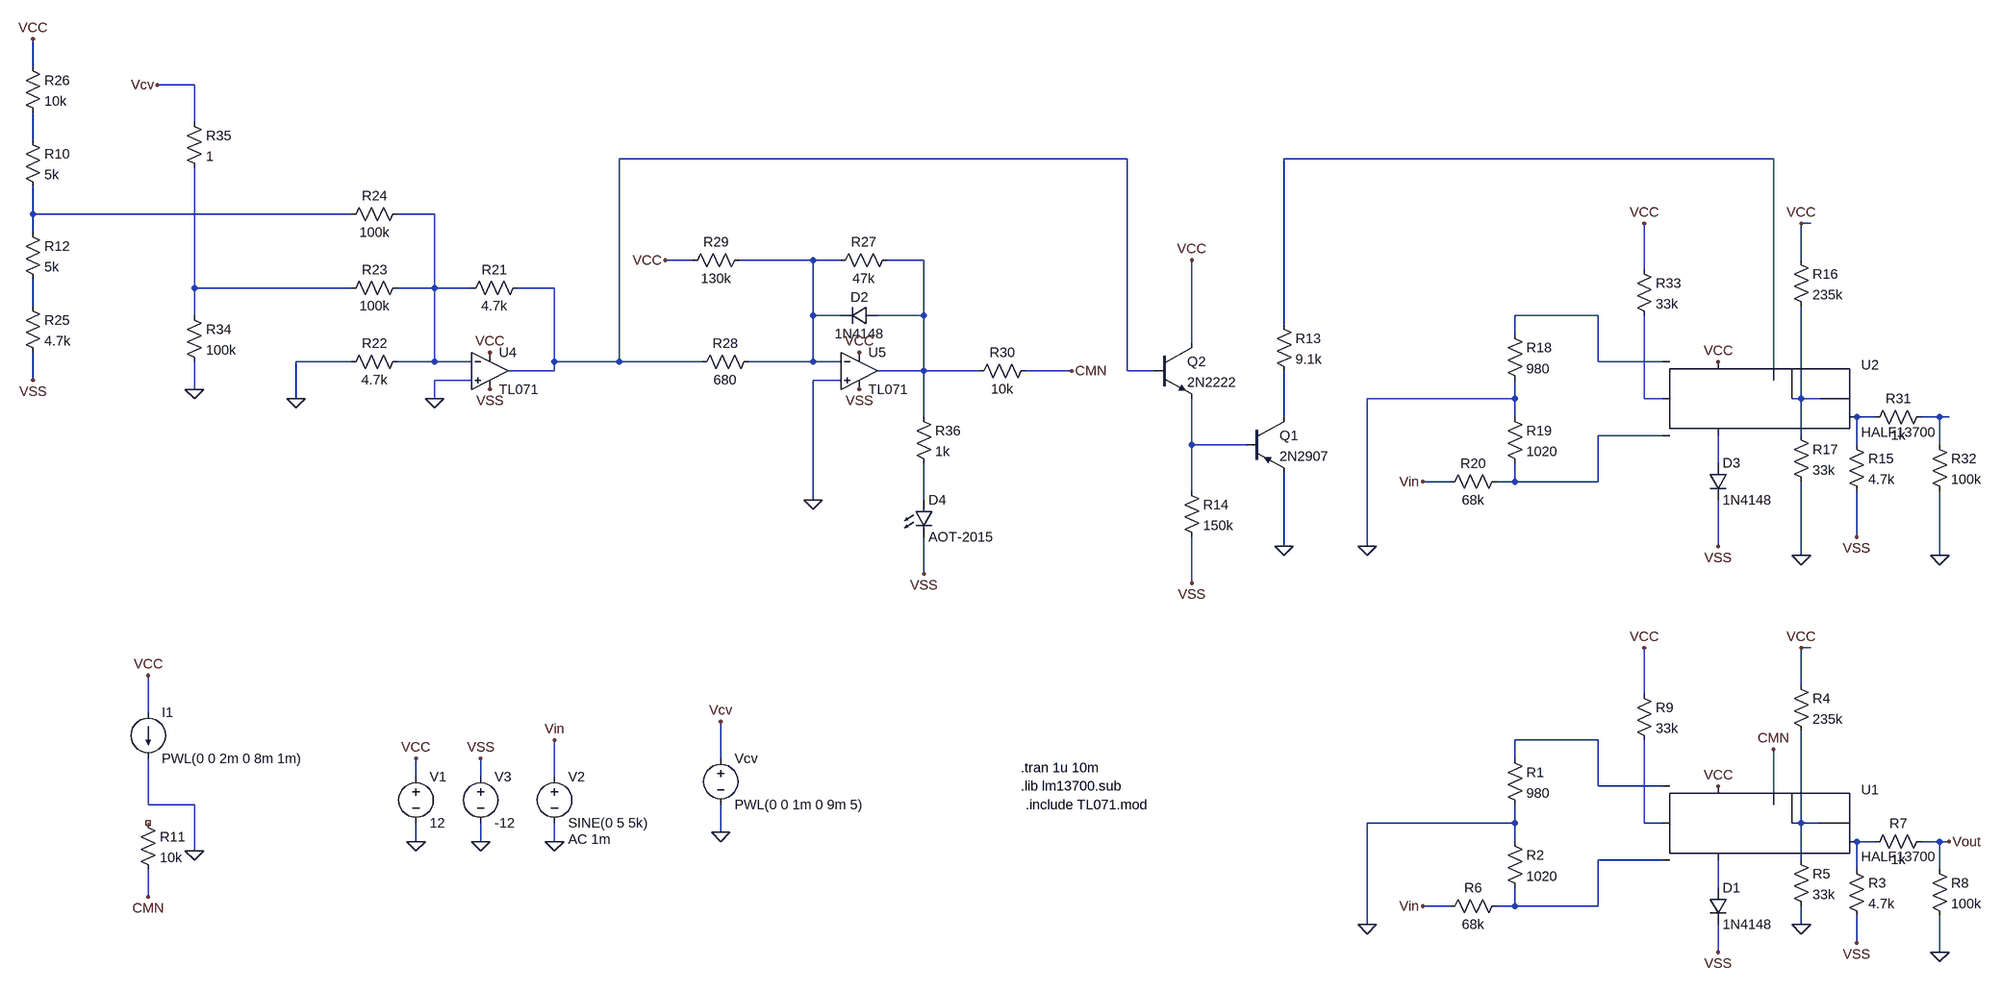
[diagram p0: schematic Linear.asc]
Linear.asc, the LTspice schematic file:
Version 4
SHEET 1 4476 1404
WIRE 608 -224 608 -272
WIRE 896 -192 832 -192
WIRE 896 -128 896 -192
WIRE 608 -96 608 -144
WIRE 2512 -64 1632 -64
WIRE 3632 -64 2784 -64
WIRE 608 32 608 -16
WIRE 1168 32 608 32
WIRE 1312 32 1248 32
WIRE 3696 48 3680 48
WIRE 608 64 608 32
WIRE 1760 112 1712 112
WIRE 1968 112 1840 112
WIRE 2016 112 1968 112
WIRE 2160 112 2096 112
WIRE 3680 112 3680 48
WIRE 3408 128 3408 48
WIRE 896 160 896 -48
WIRE 1168 160 896 160
WIRE 1312 160 1312 32
WIRE 1312 160 1248 160
WIRE 1376 160 1312 160
WIRE 1520 160 1456 160
WIRE 608 192 608 144
WIRE 896 208 896 160
WIRE 1968 208 1968 112
WIRE 2016 208 1968 208
WIRE 2160 208 2160 112
WIRE 2160 208 2080 208
WIRE 3328 208 3184 208
WIRE 2784 224 2784 -64
WIRE 3184 240 3184 208
WIRE 2624 256 2624 112
WIRE 1168 288 1072 288
WIRE 1312 288 1312 160
WIRE 1312 288 1248 288
WIRE 1376 288 1312 288
WIRE 1520 288 1520 160
WIRE 1632 288 1632 -64
WIRE 1632 288 1520 288
WIRE 1776 288 1632 288
WIRE 1968 288 1968 208
WIRE 1968 288 1856 288
WIRE 2016 288 1968 288
WIRE 3328 288 3328 208
WIRE 3440 288 3328 288
WIRE 1520 304 1520 288
WIRE 1520 304 1440 304
WIRE 2160 304 2160 208
WIRE 2160 304 2080 304
WIRE 2256 304 2160 304
WIRE 2416 304 2336 304
WIRE 2512 304 2512 -64
WIRE 2560 304 2512 304
WIRE 608 320 608 272
WIRE 1376 320 1312 320
WIRE 2016 320 1968 320
WIRE 3632 320 3632 -64
WIRE 896 336 896 288
WIRE 1072 352 1072 288
WIRE 1312 352 1312 320
WIRE 3184 352 3184 320
WIRE 3184 352 2928 352
WIRE 3408 352 3408 208
WIRE 3440 352 3408 352
WIRE 3680 352 3680 192
WIRE 3680 352 3664 352
WIRE 3712 352 3680 352
WIRE 2160 384 2160 304
WIRE 2784 384 2784 304
WIRE 3184 384 3184 352
WIRE 3808 384 3776 384
WIRE 3920 384 3888 384
WIRE 3936 384 3920 384
WIRE 3440 416 3328 416
WIRE 3680 416 3680 352
WIRE 2624 432 2624 352
WIRE 2720 432 2624 432
WIRE 3776 432 3776 384
WIRE 3920 432 3920 384
WIRE 3536 464 3536 416
WIRE 3072 496 3024 496
WIRE 3184 496 3184 464
WIRE 3184 496 3152 496
WIRE 3328 496 3328 416
WIRE 3328 496 3184 496
WIRE 2624 512 2624 432
WIRE 1968 528 1968 320
WIRE 2160 528 2160 464
WIRE 3776 592 3776 512
WIRE 2784 608 2784 480
WIRE 2928 608 2928 352
WIRE 3536 608 3536 528
WIRE 3680 624 3680 496
WIRE 3920 624 3920 512
WIRE 2160 656 2160 592
WIRE 2624 672 2624 592
WIRE 3696 784 3680 784
WIRE 3680 848 3680 784
WIRE 3408 864 3408 784
WIRE 816 896 816 832
WIRE 3328 944 3184 944
WIRE 1808 976 1808 912
WIRE 3184 976 3184 944
WIRE 1280 1008 1280 976
WIRE 1392 1008 1392 976
WIRE 1520 1008 1520 944
WIRE 3328 1024 3328 944
WIRE 3440 1024 3328 1024
WIRE 816 1056 816 976
WIRE 896 1056 816 1056
WIRE 3632 1056 3632 960
WIRE 3184 1088 3184 1056
WIRE 3184 1088 2928 1088
WIRE 3408 1088 3408 944
WIRE 3440 1088 3408 1088
WIRE 3680 1088 3680 928
WIRE 3680 1088 3664 1088
WIRE 3712 1088 3680 1088
WIRE 1808 1104 1808 1056
WIRE 1280 1120 1280 1088
WIRE 1392 1120 1392 1088
WIRE 1520 1120 1520 1088
WIRE 3184 1120 3184 1088
WIRE 3808 1120 3776 1120
WIRE 3920 1120 3888 1120
WIRE 3936 1120 3920 1120
WIRE 896 1136 896 1056
WIRE 3440 1152 3328 1152
WIRE 3680 1152 3680 1088
WIRE 3776 1168 3776 1120
WIRE 3920 1168 3920 1120
WIRE 3536 1200 3536 1152
WIRE 816 1216 816 1168
WIRE 3072 1232 3024 1232
WIRE 3184 1232 3184 1200
WIRE 3184 1232 3152 1232
WIRE 3328 1232 3328 1152
WIRE 3328 1232 3184 1232
WIRE 2928 1264 2928 1088
WIRE 3680 1264 3680 1232
WIRE 3776 1296 3776 1248
WIRE 3536 1312 3536 1264
WIRE 3920 1312 3920 1248
FLAG 1280 1120 0
FLAG 1280 976 VCC
FLAG 3536 1312 VSS
FLAG 3536 1024 VCC
FLAG 816 832 VCC
FLAG 3680 784 VCC
FLAG 1392 1120 0
FLAG 1392 976 VSS
FLAG 1520 1120 0
FLAG 3680 1264 0
FLAG 3776 1296 VSS
FLAG 1520 944 Vin
FLAG 3024 1232 Vin
FLAG 2928 1264 0
FLAG 3936 1120 Vout
FLAG 3920 1312 0
FLAG 3408 784 VCC
FLAG 3632 960 CMN
FLAG 816 1216 CMN
FLAG 1808 1104 0
FLAG 1808 912 Vcv
FLAG 896 1136 0
FLAG 1408 272 VCC
FLAG 1408 336 VSS
FLAG 1072 352 0
FLAG 1312 352 0
FLAG 608 320 VSS
FLAG 1968 528 0
FLAG 1712 112 VCC
FLAG 2048 272 VCC
FLAG 2048 336 VSS
FLAG 2416 304 CMN
FLAG 608 -272 VCC
FLAG 2624 672 VSS
FLAG 2624 112 VCC
FLAG 3536 608 VSS
FLAG 3536 288 VCC
FLAG 3680 48 VCC
FLAG 3680 624 0
FLAG 3776 592 VSS
FLAG 3024 496 Vin
FLAG 2928 608 0
FLAG 3920 624 0
FLAG 3408 48 VCC
FLAG 896 336 0
FLAG 832 -192 Vcv
FLAG 2784 608 0
FLAG 2160 656 VSS
SYMBOL LM13700 3504 1008 R0
SYMATTR InstName U1
SYMBOL voltage 1280 992 R0
WINDOW 123 0 0 Left 2
WINDOW 39 0 0 Left 2
SYMATTR InstName V1
SYMATTR Value 12
SYMBOL res 3760 1152 R0
SYMATTR InstName R3
SYMATTR Value 4.7k
SYMBOL voltage 1520 992 R0
WINDOW 123 24 124 Left 2
WINDOW 39 0 0 Left 2
SYMATTR Value2 AC 1m
SYMATTR InstName V2
SYMATTR Value SINE(0 5 5k)
SYMBOL current 816 896 R0
SYMATTR InstName I1
SYMATTR Value PWL(0 0 2m 0 8m 1m)
SYMBOL res 3664 832 R0
SYMATTR InstName R4
SYMATTR Value 235k
SYMBOL res 3664 1136 R0
SYMATTR InstName R5
SYMATTR Value 33k
SYMBOL voltage 1392 992 R0
WINDOW 123 0 0 Left 2
WINDOW 39 0 0 Left 2
SYMATTR InstName V3
SYMATTR Value -12
SYMBOL res 3168 960 R0
SYMATTR InstName R1
SYMATTR Value 980
SYMBOL res 3168 1104 R0
SYMATTR InstName R2
SYMATTR Value 1020
SYMBOL res 3168 1216 R90
WINDOW 0 0 56 VBottom 2
WINDOW 3 32 56 VTop 2
SYMATTR InstName R6
SYMATTR Value 68k
SYMBOL res 3904 1104 R90
WINDOW 0 0 56 VBottom 2
WINDOW 3 32 56 VTop 2
SYMATTR InstName R7
SYMATTR Value 1k
SYMBOL res 3904 1152 R0
SYMATTR InstName R8
SYMATTR Value 100k
SYMBOL res 3392 848 R0
SYMATTR InstName R9
SYMATTR Value 33k
SYMBOL res 800 1072 R0
SYMATTR InstName R11
SYMATTR Value 10k
SYMBOL voltage 1808 960 R0
SYMATTR InstName Vcv
SYMATTR Value PWL(0 0 1m 0 9m 5)
SYMBOL Opamps\\opamp2 1408 240 R0
SYMATTR InstName U4
SYMATTR Value TL071
SYMBOL res 1472 144 R90
WINDOW 0 0 56 VBottom 2
WINDOW 3 32 56 VTop 2
SYMATTR InstName R21
SYMATTR Value 4.7k
SYMBOL res 1264 272 R90
WINDOW 0 0 56 VBottom 2
WINDOW 3 32 56 VTop 2
SYMATTR InstName R22
SYMATTR Value 4.7k
SYMBOL res 1264 144 R90
WINDOW 0 0 56 VBottom 2
WINDOW 3 32 56 VTop 2
SYMATTR InstName R23
SYMATTR Value 100k
SYMBOL res 1264 16 R90
WINDOW 0 0 56 VBottom 2
WINDOW 3 32 56 VTop 2
SYMATTR InstName R24
SYMATTR Value 100k
SYMBOL res 592 176 R0
SYMATTR InstName R25
SYMATTR Value 4.7k
SYMBOL res 592 -240 R0
SYMATTR InstName R26
SYMATTR Value 10k
SYMBOL Opamps\\opamp2 2048 240 R0
SYMATTR InstName U5
SYMATTR Value TL071
SYMBOL res 2112 96 R90
WINDOW 0 0 56 VBottom 2
WINDOW 3 32 56 VTop 2
SYMATTR InstName R27
SYMATTR Value 47k
SYMBOL res 1872 272 R90
WINDOW 0 0 56 VBottom 2
WINDOW 3 32 56 VTop 2
SYMATTR InstName R28
SYMATTR Value 680
SYMBOL res 1856 96 R90
WINDOW 0 0 56 VBottom 2
WINDOW 3 32 56 VTop 2
SYMATTR InstName R29
SYMATTR Value 130k
SYMBOL diode 2080 192 R90
WINDOW 0 0 32 VBottom 2
WINDOW 3 32 32 VTop 2
SYMATTR InstName D2
SYMATTR Value 1N4148
SYMBOL res 2352 288 R90
WINDOW 0 0 56 VBottom 2
WINDOW 3 32 56 VTop 2
SYMATTR InstName R30
SYMATTR Value 10k
SYMBOL diode 3520 1200 R0
SYMATTR InstName D1
SYMATTR Value 1N4148
SYMBOL res 592 -112 R0
SYMATTR InstName R10
SYMATTR Value 5k
SYMBOL res 592 48 R0
SYMATTR InstName R12
SYMATTR Value 5k
SYMBOL pnp 2720 384 R0
SYMATTR InstName Q1
SYMATTR Value 2N2907
SYMBOL npn 2560 256 R0
SYMATTR InstName Q2
SYMATTR Value 2N2222
SYMBOL res 2768 208 R0
SYMATTR InstName R13
SYMATTR Value 9.1k
SYMBOL res 2608 496 R0
SYMATTR InstName R14
SYMATTR Value 150k
SYMBOL LM13700 3504 272 R0
SYMATTR InstName U2
SYMBOL res 3760 416 R0
SYMATTR InstName R15
SYMATTR Value 4.7k
SYMBOL res 3664 96 R0
SYMATTR InstName R16
SYMATTR Value 235k
SYMBOL res 3664 400 R0
SYMATTR InstName R17
SYMATTR Value 33k
SYMBOL res 3168 224 R0
SYMATTR InstName R18
SYMATTR Value 980
SYMBOL res 3168 368 R0
SYMATTR InstName R19
SYMATTR Value 1020
SYMBOL res 3168 480 R90
WINDOW 0 0 56 VBottom 2
WINDOW 3 32 56 VTop 2
SYMATTR InstName R20
SYMATTR Value 68k
SYMBOL res 3904 368 R90
WINDOW 0 0 56 VBottom 2
WINDOW 3 32 56 VTop 2
SYMATTR InstName R31
SYMATTR Value 1k
SYMBOL res 3904 416 R0
SYMATTR InstName R32
SYMATTR Value 100k
SYMBOL res 3392 112 R0
SYMATTR InstName R33
SYMATTR Value 33k
SYMBOL diode 3520 464 R0
SYMATTR InstName D3
SYMATTR Value 1N4148
SYMBOL res 880 192 R0
SYMATTR InstName R34
SYMATTR Value 100k
SYMBOL res 880 -144 R0
SYMATTR InstName R35
SYMATTR Value 1
SYMBOL res 2144 368 R0
SYMATTR InstName R36
SYMATTR Value 1k
SYMBOL LED 2144 528 R0
SYMATTR InstName D4
SYMATTR Value AOT-2015
SYMATTR Description Diode
SYMATTR Type diode
TEXT 2328 1024 Left 2 !.lib lm13700.sub
TEXT 2328 992 Left 2 !.tran 1u 10m
TEXT 2336 1056 Left 2 !.include TL071.mod

The netlist it stands for:
* Linear.asc
XU1 N021 N024 N020 CMN N022 VCC N025 N022 N023 HALF13700
V1 VCC 0 12
R3 N023 VSS 4.7k
V2 Vin 0 SINE(0 5 5k) AC 1m
I1 VCC 0 PWL(0 0 2m 0 8m 1m)
R4 VCC N022 235k
R5 N022 0 33k
V3 VSS 0 -12
R1 N020 0 980
R2 0 N024 1020
R6 N024 Vin 68k
R7 Vout N023 1k
R8 Vout 0 100k
R9 VCC N021 33k
R11 NC_01 CMN 10k
Vcv Vcv 0 PWL(0 0 1m 0 9m 5)
XU4 0 N005 VCC VSS N002 TL071  ; pins In+ In- V+ V- OUT
R21 N002 N005 4.7k
R22 N005 0 4.7k
R23 N005 N008 100k
R24 N005 N004 100k
R25 N009 VSS 4.7k
R26 VCC N001 10k
XU5 0 N006 VCC VSS N007 TL071  ; pins In+ In- V+ V- OUT
R27 N007 N006 47k
R28 N006 N002 680
R29 N006 VCC 130k
D2 N007 N006 1N4148
R30 CMN N007 10k
D1 N025 VSS 1N4148
R10 N001 N004 5k
R12 N004 N009 5k
Q1 N013 N017 0 0 2N2907
Q2 VCC N002 N017 0 2N2222
R13 N003 N013 9.1k
R14 N017 VSS 150k
XU2 N011 N016 N010 N003 N012 VCC N018 N012 N014 HALF13700
R15 N014 VSS 4.7k
R16 VCC N012 235k
R17 N012 0 33k
R18 N010 0 980
R19 0 N016 1020
R20 N016 Vin 68k
R31 N015 N014 1k
R32 N015 0 100k
R33 VCC N011 33k
D3 N018 VSS 1N4148
R34 N008 0 100k
R35 Vcv N008 1
R36 N007 N019 1k
D4 N019 VSS AOT-2015
.model D D
.lib standard.dio
.model NPN NPN
.model PNP PNP
.lib standard.bjt
.lib lm13700.sub
.tran 1u 10m
.include TL071.mod
.backanno
.end